# EAGLE schematic soil temp v0.2 (EAGLE 9.1.3)
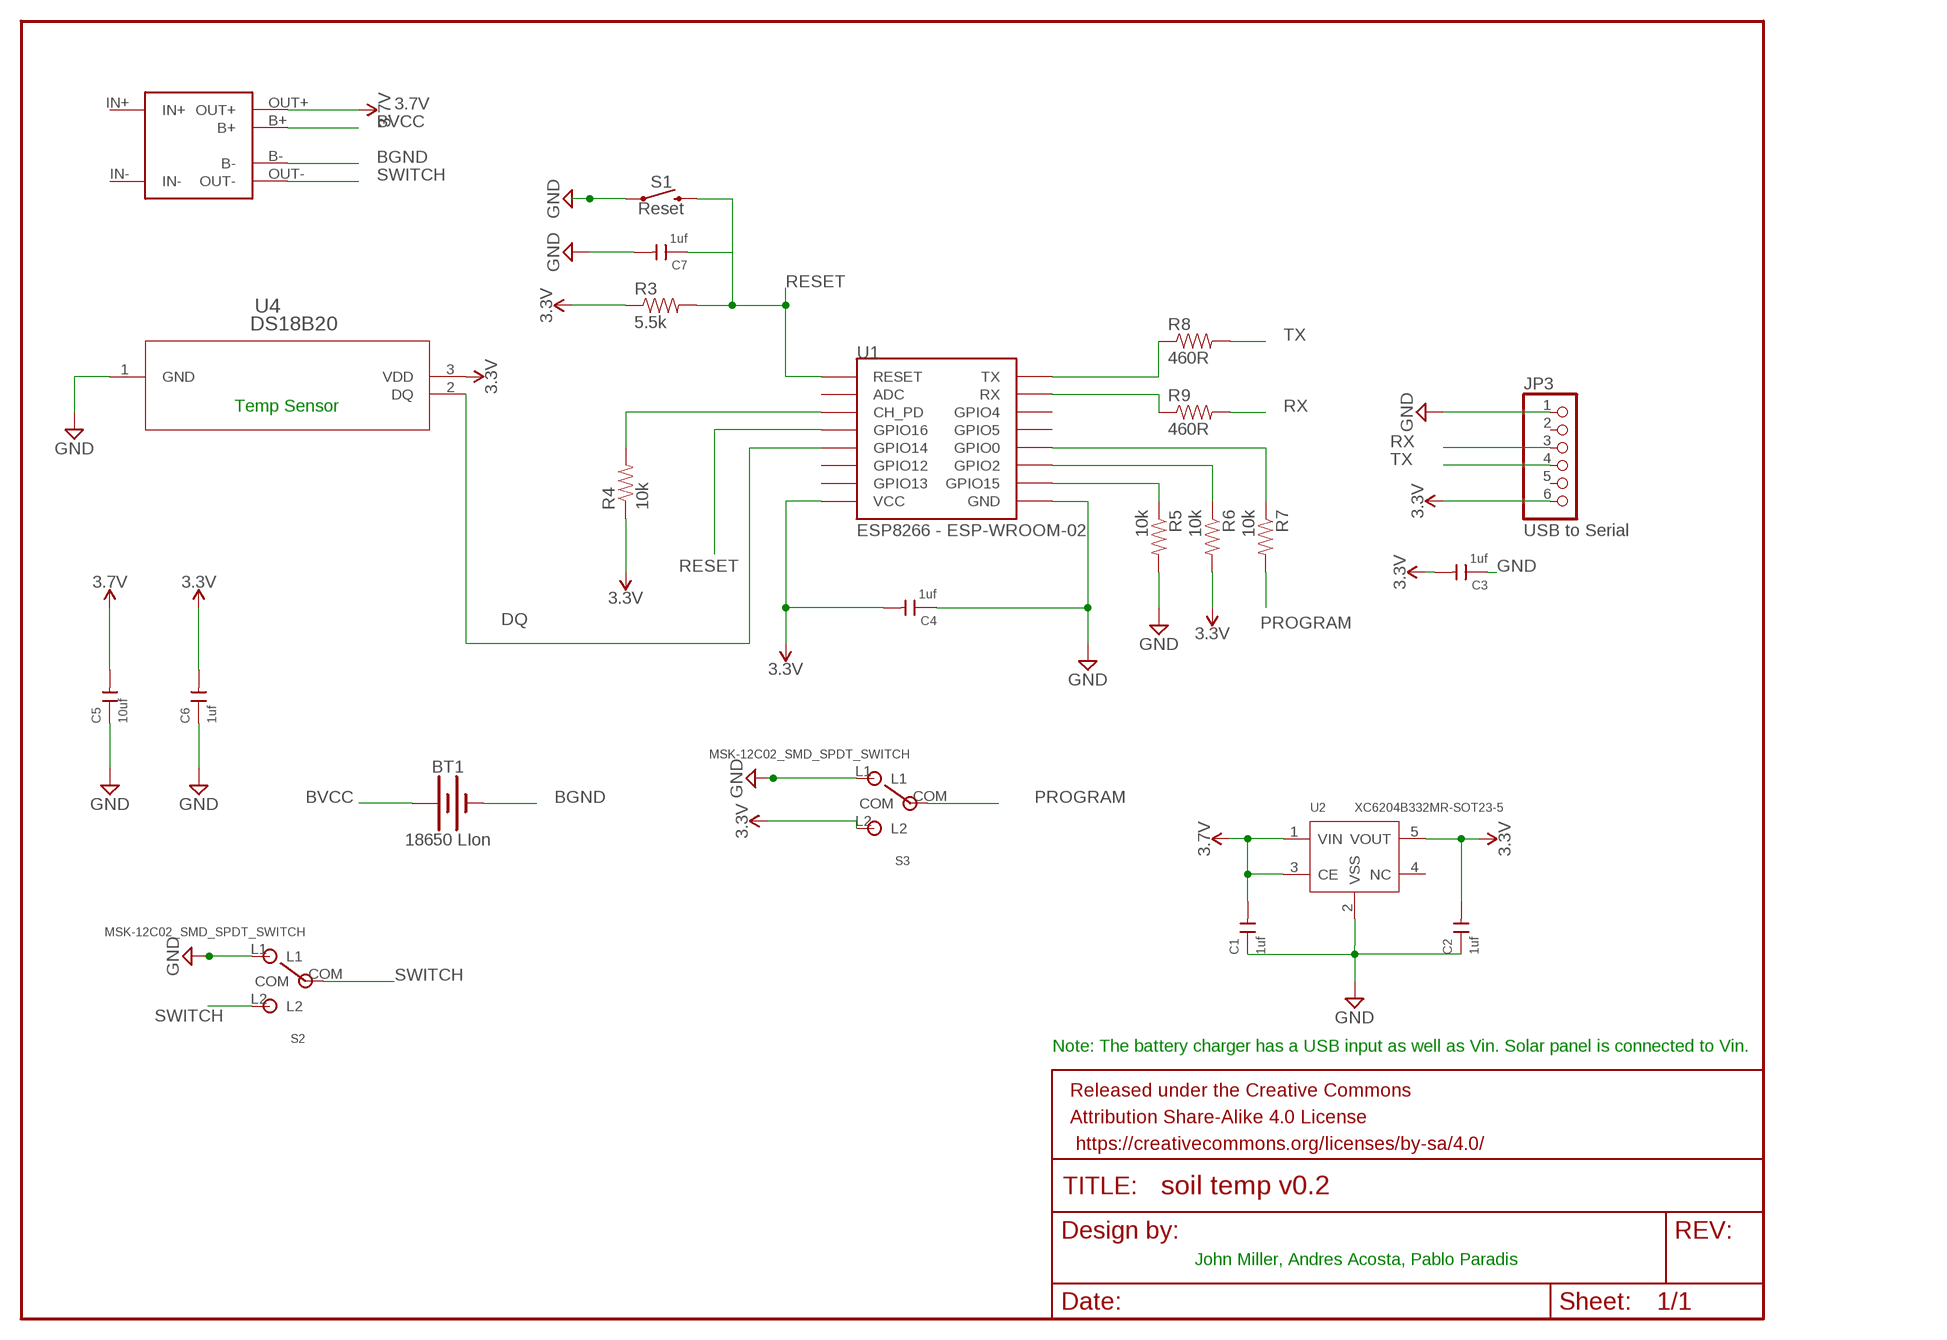
[diagram p0: schematic, sheet 1]

## Parts
BT1  18650 LIon  BATTERY-18650  [BATTERY_18650-HOLDER]
C1  1uf  CERAMIC-1UF-25V-10%-X7R(0805)  [C0805]
C2  1uf  CERAMIC-1UF-25V-10%-X7R(0805)  [C0805]
C3  1uf  CERAMIC-1UF-25V-10%-X7R(0805)  [C0805]
C4  1uf  CERAMIC-1UF-25V-10%-X7R(0805)  [C0805]
C5  10uf  CERAMIC-1UF-25V-10%-X7R(0805)  [C0805]
C6  1uf  CERAMIC-1UF-25V-10%-X7R(0805)  [C0805]
C7  1uf  CERAMIC-1UF-25V-10%-X7R(0805)  [C0805]
FRAME1  FRAME-LETTERNO_PACKAGE  [DUMMY]
JP3  USB to Serial  PINHD-1X6/90  [1X06/90]
R3  5.5k  RESISTOR0805  [R0805]
R4  10k  RESISTOR0805  [R0805]
R5  10k  RESISTOR0805  [R0805]
R6  10k  RESISTOR0805  [R0805]
R7  10k  RESISTOR0805  [R0805]
R8  460R  RESISTOR0805  [R0805]
R9  460R  RESISTOR0805  [R0805]
S1  Reset  MOMENTARY-SWITCH-SPST-SMD-6.2MM-TALL  [TACTILE_SWITCH_SMD_6.2MM_TALL]
S2  MSK-12C02_SMD_SPDT_SWITCH  [MSK-12C02]
S3  MSK-12C02_SMD_SPDT_SWITCH  [MSK-12C02]
U1  ESP8266 - ESP-WROOM-02  ESP12  [ESP12]
U2  XC6204B332MR-SOT23-5  PMIC-LDO-XC6204B332MR(SOT23-5)  [SOT-23-5]
U3  TP4056-MODULE  [TP4056-LITHIUM-PROTECTED-MODULE]
U4  DS18B20  [21-0248A]

## Nets
3.3V: C2.2 C3.2 C4.2 C6.2 JP3.6 R3.1 R4.1 R6.2 S3.L2 U1.VCC U2.5(VOUT) U4.3(VDD)
3.7V: C1.2 C5.2 U2.1(VIN) U2.3(CE) U3.OUT+
BGND: BT1.GND@1(-) U3.B-
BVCC: BT1.PWR@1(+) U3.B+
DQ: U1.GPIO14 U4.2(DQ)
GND: C1.1 C2.1 C3.1 C4.1 C5.1 C6.1 C7.2 JP3.1 R5.2 S1.A2 S2.L1 S3.L1 U1.GND U2.2(VSS) U4.1(GND)
N$1: R4.2 U1.CH_PD
N$2: R5.1 U1.GPIO15
N$3: R6.1 U1.GPIO2
N$4: R7.1 U1.GPIO0
PROGRAM: R7.2 S3.COM
R2RX: R9.1 U1.RX
R2TX: R8.1 U1.TX
RESET: C7.1 R3.2 S1.B2 U1.GPIO16 U1.RESET
RX: JP3.3 R9.2
SWITCH: S2.COM S2.L2 U3.OUT-
TX: JP3.4 R8.2
Unconnected: JP3.2 JP3.5 U1.ADC U1.GPIO4 U1.GPIO5 U1.GPIO12 U1.GPIO13 U2.4(NC)

## Notes on the sheet
- Temp Sensor
- Note: The battery charger has a USB input as well as Vin. Solar panel is connected to Vin.
- John Miller, Andres Acosta, Pablo Paradis

## Power pins joined to a net without a drawn wire
IN+: U3.IN+
IN-: U3.IN-

## Library data of the parts
BT1 = SparkFun-Batteries:BATTERY: Battery - Single Cell A variety of battery chemistries, sizes, and footprints. Device List: 20MM_PTH - Coin Cell Battery Holder - 20mm (PTH) <https://www.sparkfun.com/products/783> 6.8MM_PTH - Coin Cell Battery Holder - 6.8MM(SMD) <https://www.digikey.com/product-detail/en/seiko-instruments/MS621FE-FL11E/728-1057-ND/1889208?WT.srch=1&gclid=CNOQ5a6LzdQCFZS2wAodXCkE0g> 12MM_SMD - Coin Cell Battery Holder - 12mm (SMD) <https://www.sparkfun.com/products/10592> 12MM_PTH - Coin Cell Battery Holder - 12mm (PTH) <https://www.sparkfun.com/products/7948> 20MM_SMD - 20mm Coin Cell Battery Holder (SMD) (2 legs) Used on the Big Time Watch Kit <https://www.sparkfun.com/products/11734> 20MM_SMD_4LEGS - Coin Cell Battery Holder - 20mm (SMD) <https://www.sparkfun.com/products/11892> 20MM_SMD_4LEGS_OVERPASTE - Coin Cell Battery Holder - 20mm (SMD) <https://www.sparkfun.com/products/11892> (Over-paste on the legs) 24.5MM_PTH - Coin Cell Battery Holder - 24.5mm (PTH) <https://www.sparkfun.com/products/8863> 9V - 9V Battery Holder - PC Mount Used on the SparkFun SparkPunk Sound Kit <https://www.sparkfun.com/products/11177> and SparkFun SparkPunk Sequencer Kit <https://www.sparkfun.com/products/12707> 18650 - Battery Holder - 18650 (PTH) <https://www.sparkfun.com/products/13113> AA - Battery Holder - 1xAA (PTH) <https://www.sparkfun.com/products/7949> AAA - Battery Holder - 1xAAA (PTH) <https://www.sparkfun.com/products/12718> AA_KIT - Battery Holder - 1xAA (PTH) <https://www.sparkfun.com/products/7949> Special kit package - pads only have exposed copper on one side of the board. AAA_KIT - Battery Holder - 1xAAA (PTH) <https://www.sparkfun.com/products/12718> Special kit package - pads only have exposed copper on one side of the board.; PROD_ID: BATT-12327; SF_SKU: PRT-13113
C1-C4 C6 C7 = Seeed-Capacitor:CERAMIC-1UF-25V-10%-X7R(0805): 302010179; MPN: CC0805KKX7R8BB105
C5 = Seeed-Capacitor:CERAMIC-1UF-25V-10%-X7R(0805): 302010179; MPN: CC0805KKX7R8BB105; VALUE: 1uf
FRAME1 = SparkFun-Aesthetics:FRAME-LETTER: Schematic Frame - Letter Standard 8.5x11 US Letter frame; DESIGNER: Nobody; VERSION: v01
JP3 = pinhead:PINHD-1X6: PIN HEADER
R3-R9 = BeagleBone_Blue_R3:RESISTOR
S1 = SparkFun-Switches:MOMENTARY-SWITCH-SPST: Momentary Switch (Pushbutton) - SPST Normally-open (NO) SPST momentary switches (buttons, pushbuttons). Variants PTH-12MM - 12mm square, through-hole Momentary Pushbutton Switch - 12mm Square <https://www.sparkfun.com/products/9190> (COM-09190) PTH-6.0MM, PTH-6.0MM-KIT - 6.0mm square, through-hole Mini Pushbutton Switch <https://www.sparkfun.com/products/97> (COM-00097) KIT package intended for soldering kit's - only one side of pads' copper is exposed. PTH-RIGHT-ANGLE-KIT - Right-angle, through-hole Right Angle Tactile Button <https://www.sparkfun.com/products/10791> - Used on SparkFun BigTime Watch Kit <https://www.sparkfun.com/products/11734> SMD-12MM - 12mm square, surface-mount Tactile Button - SMD (12mm) <https://www.sparkfun.com/products/12993> (COM-12993) Used on SparkFun PicoBoard <https://www.sparkfun.com/products/11888> SMD-4.5MM - 4.5mm Square Trackball Switch Used on SparkFun Blackberry Trackballer Breakout <https://www.sparkfun.com/products/13169> SMD-4.6MMX2.8MM - 4.60mm x 2.80mm, surface mount Used on SparkFun SAMD21 Mini Breakout <https://www.sparkfun.com/products/13664> SMD-5.2MM, SMD-5.2-REDUNDANT - 5.2mm square, surface-mount Mini Pushbutton Switch - SMD <https://www.sparkfun.com/products/8720> (COM-08720) Used on Arduino Pro Mini <https://www.sparkfun.com/products/11114> REDUNDANT package connects both switch circuits together SMD-6.0X3.5MM - 6.0 x 3.5mm, surface mount Momentary Reset Switch SMD <https://www.sparkfun.com/products/8229> (COM-08229) SMD-6.2MM-TALL - 6.2mm square, surface mount Tactile Button - SMD (6mm) <https://www.sparkfun.com/products/12992> Used on SparkFun Digital Sandbox <https://www.sparkfun.com/products/12651> SMD-RIGHT-ANGLE - Right-angle, surface mount Used on SparkFun Block for Intel® Edison - Arduino <https://www.sparkfun.com/products/13036>; PROD_ID: SWCH-11966; SF_SKU: COM-12992
S2 S3 = MSK-12C02 SMD Micro Slider Switch SPDT:MSK-12C02_SMD_SPDT_SWITCH: Footprint of the VIMEX MSK-12C02 SPDT SMD Switch Created by mzst on 17-Jan-2016
U1 = esp8266modules:ESP12: ESP8266 Wifi module 12
U2 = Seeed-IC:PMIC-LDO-XC6204B332MR(SOT23-5): 310030046; MPN: XC6204B332MR
U3 = userlib:TP4056-MODULE
U4 = ds18b20:DS18B20; MANUFACTURER_PART_NUMBER: DS18B20; VENDOR: Maxim Integrated Products